# Altium schematic sheet LTM8032_3V8.SchDoc
size A3; DocumentNumber: 10; SheetNumber: 10; SheetTotal: 10
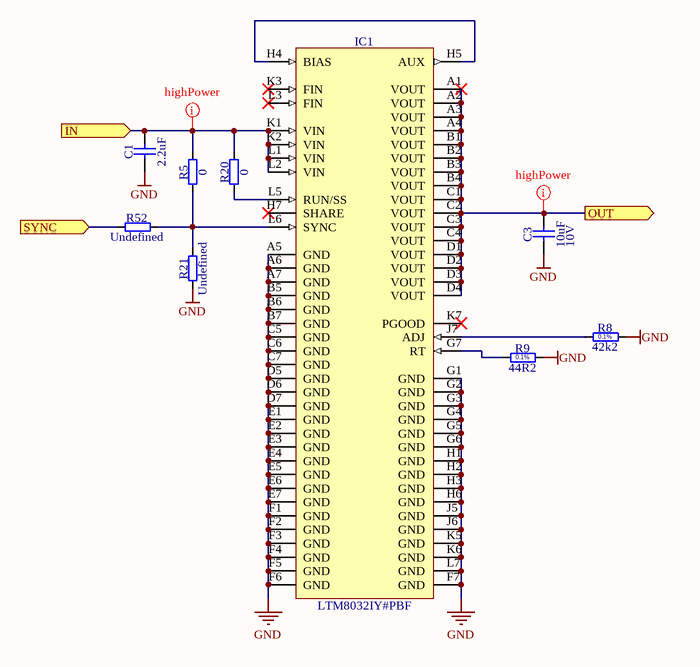
[diagram p0: LTM8032_3V8.SchDoc]

## Parts
C1  2.2uF  [CAPC3216X180N]
C3  10uF  Voltage: 10V  [CAPC2012X135N]
IC1  LTM8032IY#PBF  [BGA71C127P7X11_900X1500X362]
R5  0  [RESC1608X55N]
R8  42k2  [RESC1608X55N]
R9  44R2  [RESC1608X55N]
R20  0  [RESC1608X55N]
R21  Undefined  [RESC1608X55N]
R52  Undefined  [RESC1608X55N]

## Ports
IN (in), OUT (out), SYNC (in)

## Nets
GND: C1.1 C3.1 IC1.A5(GND) IC1.A6(GND) IC1.A7(GND) IC1.B5(GND) IC1.B6(GND) IC1.B7(GND) IC1.C5(GND) IC1.C6(GND) IC1.C7(GND) IC1.D5(GND) IC1.D6(GND) IC1.D7(GND) IC1.E1(GND) IC1.E2(GND) IC1.E3(GND) IC1.E4(GND) IC1.E5(GND) IC1.E6(GND) IC1.E7(GND) IC1.F1(GND) IC1.F2(GND) IC1.F3(GND) IC1.F4(GND) IC1.F5(GND) IC1.F6(GND) IC1.F7(GND) IC1.G1(GND) IC1.G2(GND) IC1.G3(GND) IC1.G4(GND) IC1.G5(GND) IC1.G6(GND) IC1.H1(GND) IC1.H2(GND) IC1.H3(GND) IC1.H6(GND) IC1.J5(GND) IC1.J6(GND) IC1.K5(GND) IC1.K6(GND) IC1.L7(GND) R8.2 R9.2 R21.1
IN: C1.2 IC1.K1(VIN) IC1.K2(VIN) IC1.L1(VIN) IC1.L2(VIN) R5.2 R20.2 ; port IN
OUT: C3.2 IC1.A1(VOUT) IC1.A2(VOUT) IC1.A3(VOUT) IC1.A4(VOUT) IC1.B1(VOUT) IC1.B2(VOUT) IC1.B3(VOUT) IC1.B4(VOUT) IC1.C1(VOUT) IC1.C2(VOUT) IC1.C3(VOUT) IC1.C4(VOUT) IC1.D1(VOUT) IC1.D2(VOUT) IC1.D3(VOUT) IC1.D4(VOUT) ; port OUT
SYNC: R52.1 ; port SYNC
NetIC1_G7: IC1.G7(RT) R9.1
NetIC1_H4: IC1.H4(BIAS) IC1.H5(AUX)
NetIC1_J7: IC1.J7(ADJ) R8.1
NetIC1_L5: IC1.L5(RUN/SS) R20.1
NetIC1_L6: IC1.L6(SYNC) R5.1 R21.2 R52.2

Not connected (* = marked no-connect by the designer): IC1 H7(SHARE)* K3(FIN)* K7(PGOOD)* L3(FIN)*

## Layout directives
net class highPower: IN, OUT

## Notes on the sheet
- (in symbol R0603_42K2_0.1%_0.063W_10PPM) 0.1%
- (in symbol R0603_44R2_0.1%_0.063W_10PPM) 0.1%

## Library data of the parts
C1 = CC1206_2.2UF_50V_10%_X7R_YUDEN_UMK316B7225KLHT: Non-polarised capacitor; Part Description: SMD Multilayer Chip Ceramic Capacitor (High Dielectric Type) for Automotive / Industrial Applications; Manufacturer: TAIYO YUDEN; Voltage: 50V; TC: X7R; Tolerance: ±10%; Part Number: CC1206_2.2UF_50V_10%_X7R_YUDEN_UMK316B7225KLHT; Component Kind: Standard; Component Type: Standard; Pin Count: 2; Value: 2.2uF; Status: Not Recommended; Manufacturer Part Number: UMK316B7225KLHT; Case: 1206; Mounted: Yes; Socket: No; SMD: Yes; Sense: No; ComponentHeight: 1.9mm; HelpURL: \\cern.ch\dfs\Applications\Altium\Datasheets\CC1206_TAIYO-YUDEN_UMK316B7225KLHT.pdf; Author: CERN DEM JLC; CreateDate: 23.04.2015; LatestRevisionDate: 17.12.2018
C3 = CC0805_10UF_10V_10%_X7R: Non-polarised capacitor; Part Description: SMD Multilayer Chip Ceramic Capacitor; Manufacturer: GENERIC; Manufacturer1 Part Number: GRM21BR71A106KE51L; TC: X7R; Tolerance: ±10%; Part Number: CC0805_10UF_10V_10%_X7R; Component Kind: Standard; Component Type: Standard; Pin Count: 2; Value: 10uF; Status: Preferred; Manufacturer Part Number: CC0805_10UF_10V_10%_X7R; Case: 0805; Mounted: Yes; Socket: No; SMD: Yes; Sense: No; Manufacturer1 Example: MURATA; Manufacturer1 ComponentHeight: 1.35mm; HelpURL: \\cern.ch\dfs\Applications\Altium\Datasheets\CC0805_X7R_MURATA.pdf; Author: CERN DEM JLC; CreateDate: 30.04.2012; LatestRevisionDate: 30.04.2012
IC1 = LTM8032IY#PBF: 3V-36V To 0.8V-10V, Iout 2A Ultralow Noise EMC Compliant DC/DC uModule; Part Description: 3V-36V To 0.8V-10V, Iout 2A, Ultralow Noise EMC Compliant DC-DC uModule; Manufacturer: LINEAR TECHNOLOGY; PressFit: No; Bonding: No; Part Number: LTM8032IY#PBF; Component Kind: Standard; Component Type: Standard; Device: LTM8032IY#PBF; PackageDescription: BGA, 1.27mm pitch, rect., 71 pin, 7 columns X 11 rows, 9mm X 15mm X 3.62mm H; Manufacturer Part Number: LTM8032IY#PBF; Pin Count: 71; Case: BGA71; Mounted: Yes; Socket: No; SMD: Yes; Sense: No; ComponentHeight: 3.62mm; HelpURL: \\cern.ch\dfs\Applications\Altium\Datasheets\LTM8032IY#PBF.pdf; Author: CERN DEM BC; CreateDate: 17.12.2018; LatestRevisionDate: 17.12.2018
R5 R20 = R0603_0R_JUMPER: Resistor; Part Description: 1A (0.05R Max DC Resistance) Zero Ohm Jumper; Manufacturer: GENERIC; Manufacturer1 Part Number: NRC06Z0; PressFit: No; Part Number: R0603_0R_JUMPER; Component Kind: Standard; Component Type: Standard; Pin Count: 2; Value: 0; Status: Preferred; Manufacturer Part Number: R0603_0R_JUMPER; Case: 0603; Mounted: Yes; Sense: No; Socket: No; SMD: Yes; Manufacturer1 Example: NIC COMPONENT; Manufacturer1 ComponentHeight: 0.55mm; HelpURL: \\cern.ch\dfs\Applications\Altium\Datasheets\R0603_NIC_NRC.pdf; Author: CERN DEM JLC; CreateDate: 03.12.2007; LatestRevisionDate: 13.03.2008
R8 = R0603_42K2_0.1%_0.063W_10PPM: Resistor - 0.1%; Part Description: Thin Film Chip Resistor; Manufacturer: GENERIC; Manufacturer1 Part Number: RN73C1J42K2BTDF; Power: 0.063W; TC: ±10ppm; PressFit: No; Part Number: R0603_42K2_0.1%_0.063W_10PPM; Component Kind: Standard; Component Type: Standard; Pin Count: 2; Value: 42k2; Status: Not Recommended; Tolerance: ±0.1%; Manufacturer Part Number: R0603_42K2_0.1%_0.063W_10PPM; Case: 0603; Mounted: Yes; Sense: No; Socket: No; SMD: Yes; Manufacturer1 Example: TYCO HOLSWORTHY; Manufacturer1 ComponentHeight: 0.5mm; HelpURL: \\cern.ch\dfs\Applications\Altium\Datasheets\R0603_Tyco_RN73.pdf; Author: CERN DEM JLC; CreateDate: 03.12.2007; LatestRevisionDate: 13.03.2008
R9 = R0603_44R2_0.1%_0.063W_10PPM: Resistor - 0.1%; Part Description: Thin Film Chip Resistor; Manufacturer: GENERIC; Manufacturer1 Part Number: RN73C1J44R2BTDF; Power: 0.063W; TC: ±10ppm; PressFit: No; Part Number: R0603_44R2_0.1%_0.063W_10PPM; Component Kind: Standard; Component Type: Standard; Pin Count: 2; Value: 44R2; Status: Not Recommended; Tolerance: ±0.1%; Manufacturer Part Number: R0603_44R2_0.1%_0.063W_10PPM; Case: 0603; Mounted: Yes; Sense: No; Socket: No; SMD: Yes; Manufacturer1 Example: TYCO HOLSWORTHY; Manufacturer1 ComponentHeight: 0.5mm; HelpURL: \\cern.ch\dfs\Applications\Altium\Datasheets\R0603_Tyco_RN73.pdf; Author: CERN DEM JLC; CreateDate: 03.12.2007; LatestRevisionDate: 13.03.2008
R21 R52 = R0603_NO-VALUE: Resistor; Part Description: Reserved Footprint For a 0603 (1608) Chip Resistor; PressFit: No; Mounted: No; Part Number: R0603_NO-VALUE; Component Kind: Standard; Component Type: Standard; Pin Count: 2; Value: Undefined; Status: None; Manufacturer: Undefined; Manufacturer Part Number: R0603_NO-VALUE; Case: 0603; Sense: No; Socket: No; SMD: Yes; Manufacturer1 Example: Undefined; Manufacturer1 Part Number: Undefined; Manufacturer1 ComponentHeight: Undefined; HelpURL: Undefined; Author: CERN DEM JLC; CreateDate: 03.12.2007; LatestRevisionDate: 13.03.2008